# EAGLE design DualPhotodiode (EAGLE 7.2.0)
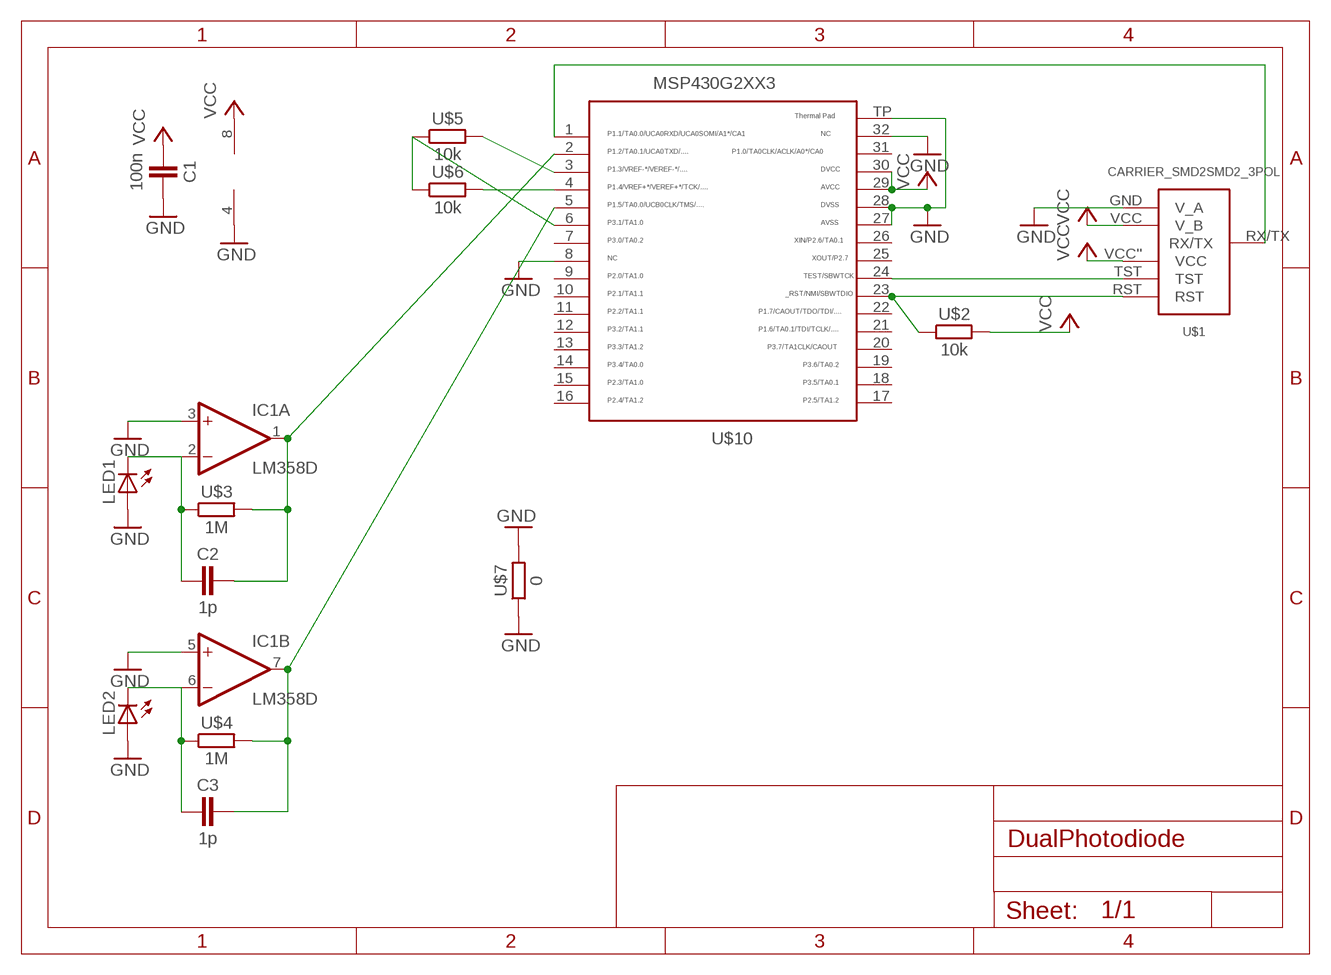
[diagram p0: schematic, sheet 1]

## Parts
C1  100n  CAPACITOR  [603]
C2  1p  CAPACITOR  [603]
C3  1p  CAPACITOR  [603]
IC1  LM358D  [SO08]
LED1  LEDCHIP-LED0805  [CHIP-LED0805]
LED2  LEDCHIP-LED0805  [CHIP-LED0805]
U$1  CARRIER_SMD2SMD2_3POL  [CARRIER_SMD2_3POL]
U$2  10k  RESISTOR0603  [603]
U$3  1M  RESISTOR0603  [603]
U$4  1M  RESISTOR0603  [603]
U$5  10k  RESISTOR0603  [603]
U$6  10k  RESISTOR0603  [603]
U$7  0  RESISTOR0603  [603]
U$10  MSP430G2553  [QFN32]

## Nets
GND: C1.2 IC1.3(A:+IN) IC1.4(P:V-) IC1.5(B:+IN) LED1.A LED2.A U$1.GND(V_A) U$7.1 U$7.2 U$10.8 U$10.27 U$10.28 U$10.32 U$10.TP
N$2: C2.1 IC1.2(A:-IN) LED1.C U$3.1
N$3: U$1.TST U$10.24
N$4: U$1.RST U$2.1 U$10.23
N$5: U$5.2 U$10.3
N$6: C3.1 IC1.6(B:-IN) LED2.C U$4.1
N$7: C3.2 IC1.7(B:OUT) U$4.2 U$10.5
N$11: C2.2 IC1.1(A:OUT) U$3.2 U$10.2
N$12: U$1.RX/TX U$10.1
N$13: U$6.2 U$10.4
N$15: U$5.1 U$6.1 U$10.6
VCC: C1.1 IC1.8(P:V+) U$1.VCC''(VCC) U$1.VCC(V_B) U$2.2 U$10.29 U$10.30
Unconnected: U$10.7 U$10.9 U$10.10 U$10.11 U$10.12 U$10.13 U$10.14 U$10.15 U$10.16 U$10.17 U$10.18 U$10.19 U$10.20 U$10.21 U$10.22 U$10.25 U$10.26 U$10.31

## Library data of the parts
C1-C3 = thar:CAPACITOR
IC1 = linear:LM358: OP AMP also LM158; LM258; LM2904 Source: http://cache.national.com/ds/LM/LM158.pdf
LED1 LED2 = led:LED: LED OSRAM: - CHIPLED LG R971, LG N971, LY N971, LG Q971, LY Q971, LO R971, LY R971 LH N974, LH R974 LS Q976, LO Q976, LY Q976 LO Q996 - Hyper CHIPLED LW Q18S LB Q993, LB Q99A, LB R99A - SideLED LS A670, LO A670, LY A670, LG A670, LP A670 LB A673, LV A673, LT A673, LW A673 LH A674 LY A675 LS A676, LA A676, LO A676, LY A676, LW A676 LS A679, LY A679, LG A679 - Hyper Micro SIDELED® LS Y876, LA Y876, LO Y876, LY Y876 LT Y87S - SmartLED LW L88C, LW L88S LB L89C, LB L89S, LG L890 LS L89K, LO L89K, LY L89K LS L896, LA L896, LO L896, LY L896 - TOPLED LS T670, LO T670, LY T670, LG T670, LP T670 LSG T670, LSP T670, LSY T670, LOP T670, LYG T670 LG T671, LOG T671, LSG T671 LB T673, LV T673, LT T673, LW T673 LH T674 LS T676, LA T676, LO T676, LY T676, LB T676, LH T676, LSB T676, LW T676 LB T67C, LV T67C, LT T67C, LS T67K, LO T67K, LY T67K, LW E67C LS E67B, LA E67B, LO E67B, LY E67B, LB E67C, LV E67C, LT E67C LW T67C LS T679, LY T679, LG T679 LS T770, LO T770, LY T770, LG T770, LP T770 LB T773, LV T773, LT T773, LW T773 LH T774 LS E675, LA E675, LY E675, LS T675 LS T776, LA T776, LO T776, LY T776, LB T776 LHGB T686 LT T68C, LB T68C - Hyper Mini TOPLED® LB M676 - Mini TOPLED Santana® LG M470 LS M47K, LO M47K, LY M47K Source: http://www.osram.convergy.de LUXEON: - LUMILED® LXK2-PW12-R00, LXK2-PW12-S00, LXK2-PW14-U00, LXK2-PW14-V00 LXK2-PM12-R00, LXK2-PM12-S00, LXK2-PM14-U00 LXK2-PE12-Q00, LXK2-PE12-R00, LXK2-PE12-S00, LXK2-PE14-T00, LXK2-PE14-U00 LXK2-PB12-K00, LXK2-PB12-L00, LXK2-PB12-M00, LXK2-PB14-N00, LXK2-PB14-P00, LXK2-PB14-Q00 LXK2-PR12-L00, LXK2-PR12-M00, LXK2-PR14-Q00, LXK2-PR14-R00 LXK2-PD12-Q00, LXK2-PD12-R00, LXK2-PD12-S00 LXK2-PH12-R00, LXK2-PH12-S00 LXK2-PL12-P00, LXK2-PL12-Q00, LXK2-PL12-R00 Source: www.luxeon.com KINGBRIGHT: KA-3528ASYC Source: www.kingbright.com
U$1 = thar:CARRIER_SMD2
U$2-U$7 = thar:RESISTOR
U$10 = thar:MSP430G2553: TEXAS INSTRUMENTS MSP430G2553IRHB32R MCU, 16BIT, MSP430, 16MHZ, QFN-32 Farnell Best.Nr.: 2325726 Herst.Bez.: MSP430G2553IRHB32R

## Board
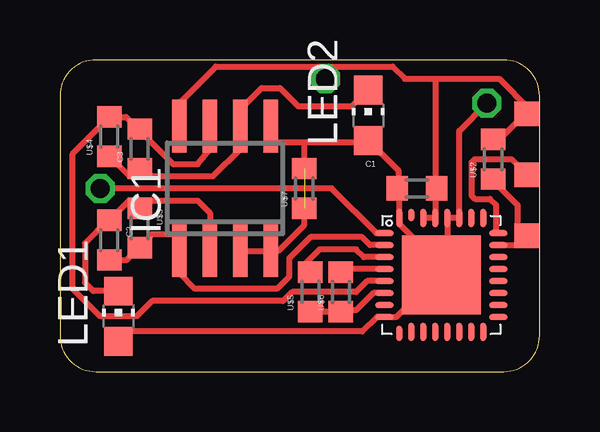
[diagram p1: board, top side]
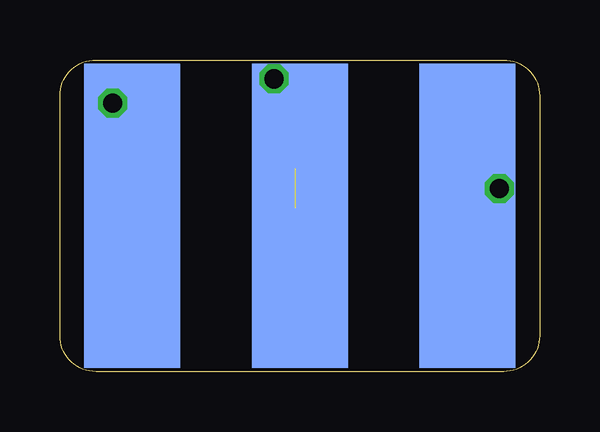
[diagram p2: board, bottom side, seen from below]

Size 20 x 13 mm. Coordinates in mm from the lower left corner, seen from the top.
Copper layers (1*16): Top 0.035mm / dielectric 1.5mm / Bottom 0.035mm
Design rules "Bilex DRU *": minimum track width 10mil, minimum drill 24mil, track to track 10mil, track to pad 10mil, pad to pad 10mil, via to via 10mil, smd to smd 10mil, copper to edge 1mil, drill to drill 8mil, minimum pad ring 10mil, minimum via ring 8mil, stop-mask expansion 4mil, vias tented up to drill 0mil, thermal gap 10mil

### Footprints (pad centres in the part's own frame; a part is rotated, then mirrored left to right if it is on the bottom)
603 = smd 0.889 x 1.016: 1 -0.826,0; 2 0.826,0
SO08 = smd 0.6 x 2.2: 1 -1.905,-2.6; 2 -0.635,-2.6; 3 0.635,-2.6; 4 1.905,-2.6; 5 1.905,2.6; 6 0.635,2.6; 7 -0.635,2.6; 8 -1.905,2.6
CHIP-LED0805 = smd 1.2 x 1.2: A 0,-1.05; C 0,1.05
CARRIER_SMD2_3POL = smd 4 x 12.7 bottom: GND -6.985,0; RX/TX 6.985,0; VCC 0,0 | smd 1.016 x 1.016: RST -9.461,0.826; TST -9.461,-1.714; VCC'' -9.461,-4.255
QFN32 = smd 0.762 x 0.254: 1 -2.375,1.75; 2 -2.375,1.25; 3 -2.375,0.75; 4 -2.375,0.25; 5 -2.375,-0.25; 6 -2.375,-0.75; 7 -2.375,-1.25; 8 -2.375,-1.75; 17 2.375,-1.75; 18 2.375,-1.25; 19 2.375,-0.75; 20 2.375,-0.25; 21 2.375,0.25; 22 2.375,0.75; 23 2.375,1.25; 24 2.375,1.75 | smd 0.254 x 0.635: 9 -1.75,-2.438 | smd 0.254 x 0.762: 10 -1.25,-2.375; 11 -0.75,-2.375; 12 -0.25,-2.375; 13 0.25,-2.375; 14 0.75,-2.375; 15 1.25,-2.375; 16 1.75,-2.375; 25 1.75,2.375; 26 1.25,2.375; 27 0.75,2.375; 28 0.25,2.375; 29 -0.25,2.375; 30 -0.75,2.375; 32 -1.75,2.375 | smd 0.254 x 0.508: 31 -1.25,2.5 | smd 3.302 x 3.302: TP 0,0

### Placement (x,y rotation side)
C1  14.89,7.64 180 top
C2  2.06,5.48 270 top
C3  3.33,9.29 90 top
IC1  6.89,7.64 0 top
LED1  2.44,2.31 0 top
LED2  12.86,10.69 0 top
U$1  10,6.5 180 top
U$2  18.06,8.86 90 top
U$3  3.33,5.99 270 top
U$4  2.06,9.8 90 top
U$5  10.44,3.32 90 top
U$6  11.71,3.32 90 top
U$7  10.19,7.64 90 top
U$10  15.9,4.03 0 top

### Tracks (layer width: path | path; a pad name or v marks a point on that pad's centre or on a via)
GND  (via drill 0.8)  (1 unrouted)
  Top 0.254: 16.43,4.35 16.19,5.38 16.16,5.35 | 16.43,4.35 16.48,3.06 U$10.TP 15.01,2.94 14.89,3.14 14.03,2.28 U$10.8 13.21,2.28 12.6,1.67 2.47,1.67 LED1.A 2.47,1.29 | 14.12,7.58 C1.2 | 16.15,4.72 U$10.28 U$10.27 16.65,10.04 v17.81,11.2 | 16.15,4.72 16.15,4.42 16.43,4.35 | 16.15,4.72 15.52,5.35 14.76,5.55 14.15,6.16 U$10.32 14.15,6.98 14.12,7.51 14.06,7.58 C1.2 | IC1.3 IC1.4 9.11,5.04 10.19,6.12 U$7.1 | IC1.5 8.79,9.54 10.19,9.54 | C1.2 14.06,7.96 14.12,8.02 14.12,8.37 LED2.A 12.44,9.64 12.35,9.54 10.19,9.54 | U$7.2 10.19,9.54
  Bottom 0.254: 18,6.5 17.81,6.69 v17.81,11.2 16.98,10.37 U$1.GND
N$2
  Top 0.254: 3.27,7.13 U$3.1 2.95,7.01 3.27,7.13 | 3.27,7.13 5.74,7.13 6.25,6.62 IC1.2 | 2.28,2.97 LED1.C 1.39,3.36 1.04,3.7 1.04,5.35 2,6.31 C2.1 2.89,7.13 3.27,7.13
N$3
  Top 0.254: 19.61,7.88 19.46,8.02 19.5,8.18 U$1.TST | U$10.24 18.19,5.78 18.19,6.95 17.93,7.21 17.3,7.21 17.17,7.33 17.17,8.73 17.3,8.86 18.82,8.86 19.43,8.25 U$1.TST | U$1.TST
N$4
  Top 0.254: 19.46,5.48 19.5,5.38 | 19.46,5.48 19.5,5.69 | 19.5,5.69 19.08,5.74 19.08,6.95 18.06,7.97 U$2.1 | U$10.23 19.28,5.28 19.46,5.48 | 19.5,5.69 19.48,5.69 U$1.RST
N$5
  Top 0.254: U$10.3 12.67,4.78 12.35,5.1 10.82,5.1 10.19,4.46 U$5.2
N$6
  Top 0.254: 2.89,8.28 C3.1 3.33,8.15 | 3.33,8.15 3.71,8.15 6.38,8.15 7.52,9.29 IC1.6 7.52,10.94 8.41,11.83 9.17,11.83 9.93,11.07 12.19,11.07 LED2.C 12.76,11.83 | U$4.1 2.89,8.15 3.33,8.15
N$7
  Top 0.254: 3.55,9.89 3.46,9.93 3.2,9.93 C3.2 3.33,10.05 | IC1.7 6.25,9.29 5.74,8.66 4.73,8.66 3.33,10.05 | U$10.5 12.8,3.78 12.35,3.32 9.68,3.32 9.3,2.94 3.84,2.94 3.2,2.31 1.68,2.31 0.54,3.45 0.54,9.1 U$4.2 2.76,10.62 3.33,10.05
N$11
  Top 0.254: 3.01,5.35 U$3.2 3.71,5.59 | 3.71,5.59 3.84,5.74 4.98,5.74 IC1.1 4.98,4.08 5.62,3.45 9.04,3.45 9.55,3.96 9.55,4.72 10.44,5.61 12.6,5.61 12.93,5.28 U$10.2 | C2.2 2.77,4.66 3.71,5.59
N$12  (via drill 0.8)
  Top 0.254: U$10.1 13.19,5.78 11.33,7.64 v1.68,7.64
  Bottom 0.254: U$1.RX/TX 3.27,8.72 v1.68,7.64
N$13
  Top 0.254: U$10.4 11.85,4.28 U$6.2
N$15
  Top 0.254: U$10.6 13.07,3.28 12.35,2.56 12.03,2.56 U$6.1 U$5.1
VCC  (via drill 0.8)
  Top 0.254: U$10.29 | 15.65,12.21 15.65,8.02 | 15.65,8.02 U$10.29 | 15.65,7.77 15.59,8.02 | 15.59,8.02 15.65,8.02 | U$10.29 U$10.30 | C1.1 15.59,8.02 | 19.5,10.52 19.46,10.56 | U$2.2 18.12,9.48 19.2,10.56 19.2,10.51 19.46,10.56 | 19.46,10.56 19.65,10.75 19.65,10.95 19.58,10.95 18.32,12.21 15.65,12.21 | 19.46,10.56 U$1.VCC'' | 11.2,12.72 6.51,12.72 4.98,11.2 IC1.8 | 11.2,12.72 13.87,12.72 14.38,12.21 15.65,12.21 | v11.08,12.21 11.08,12.59 11.2,12.72
  Bottom 0.254: U$1.VCC 10,11.64 11.08,12.72 v11.08,12.21